# EasyEDA schematic Phantom Controller.json
TITLE: Phantom Controller; REV: 1.1; Date: 2022-01-25; Sheet: 1/1; Company: madtek.ro
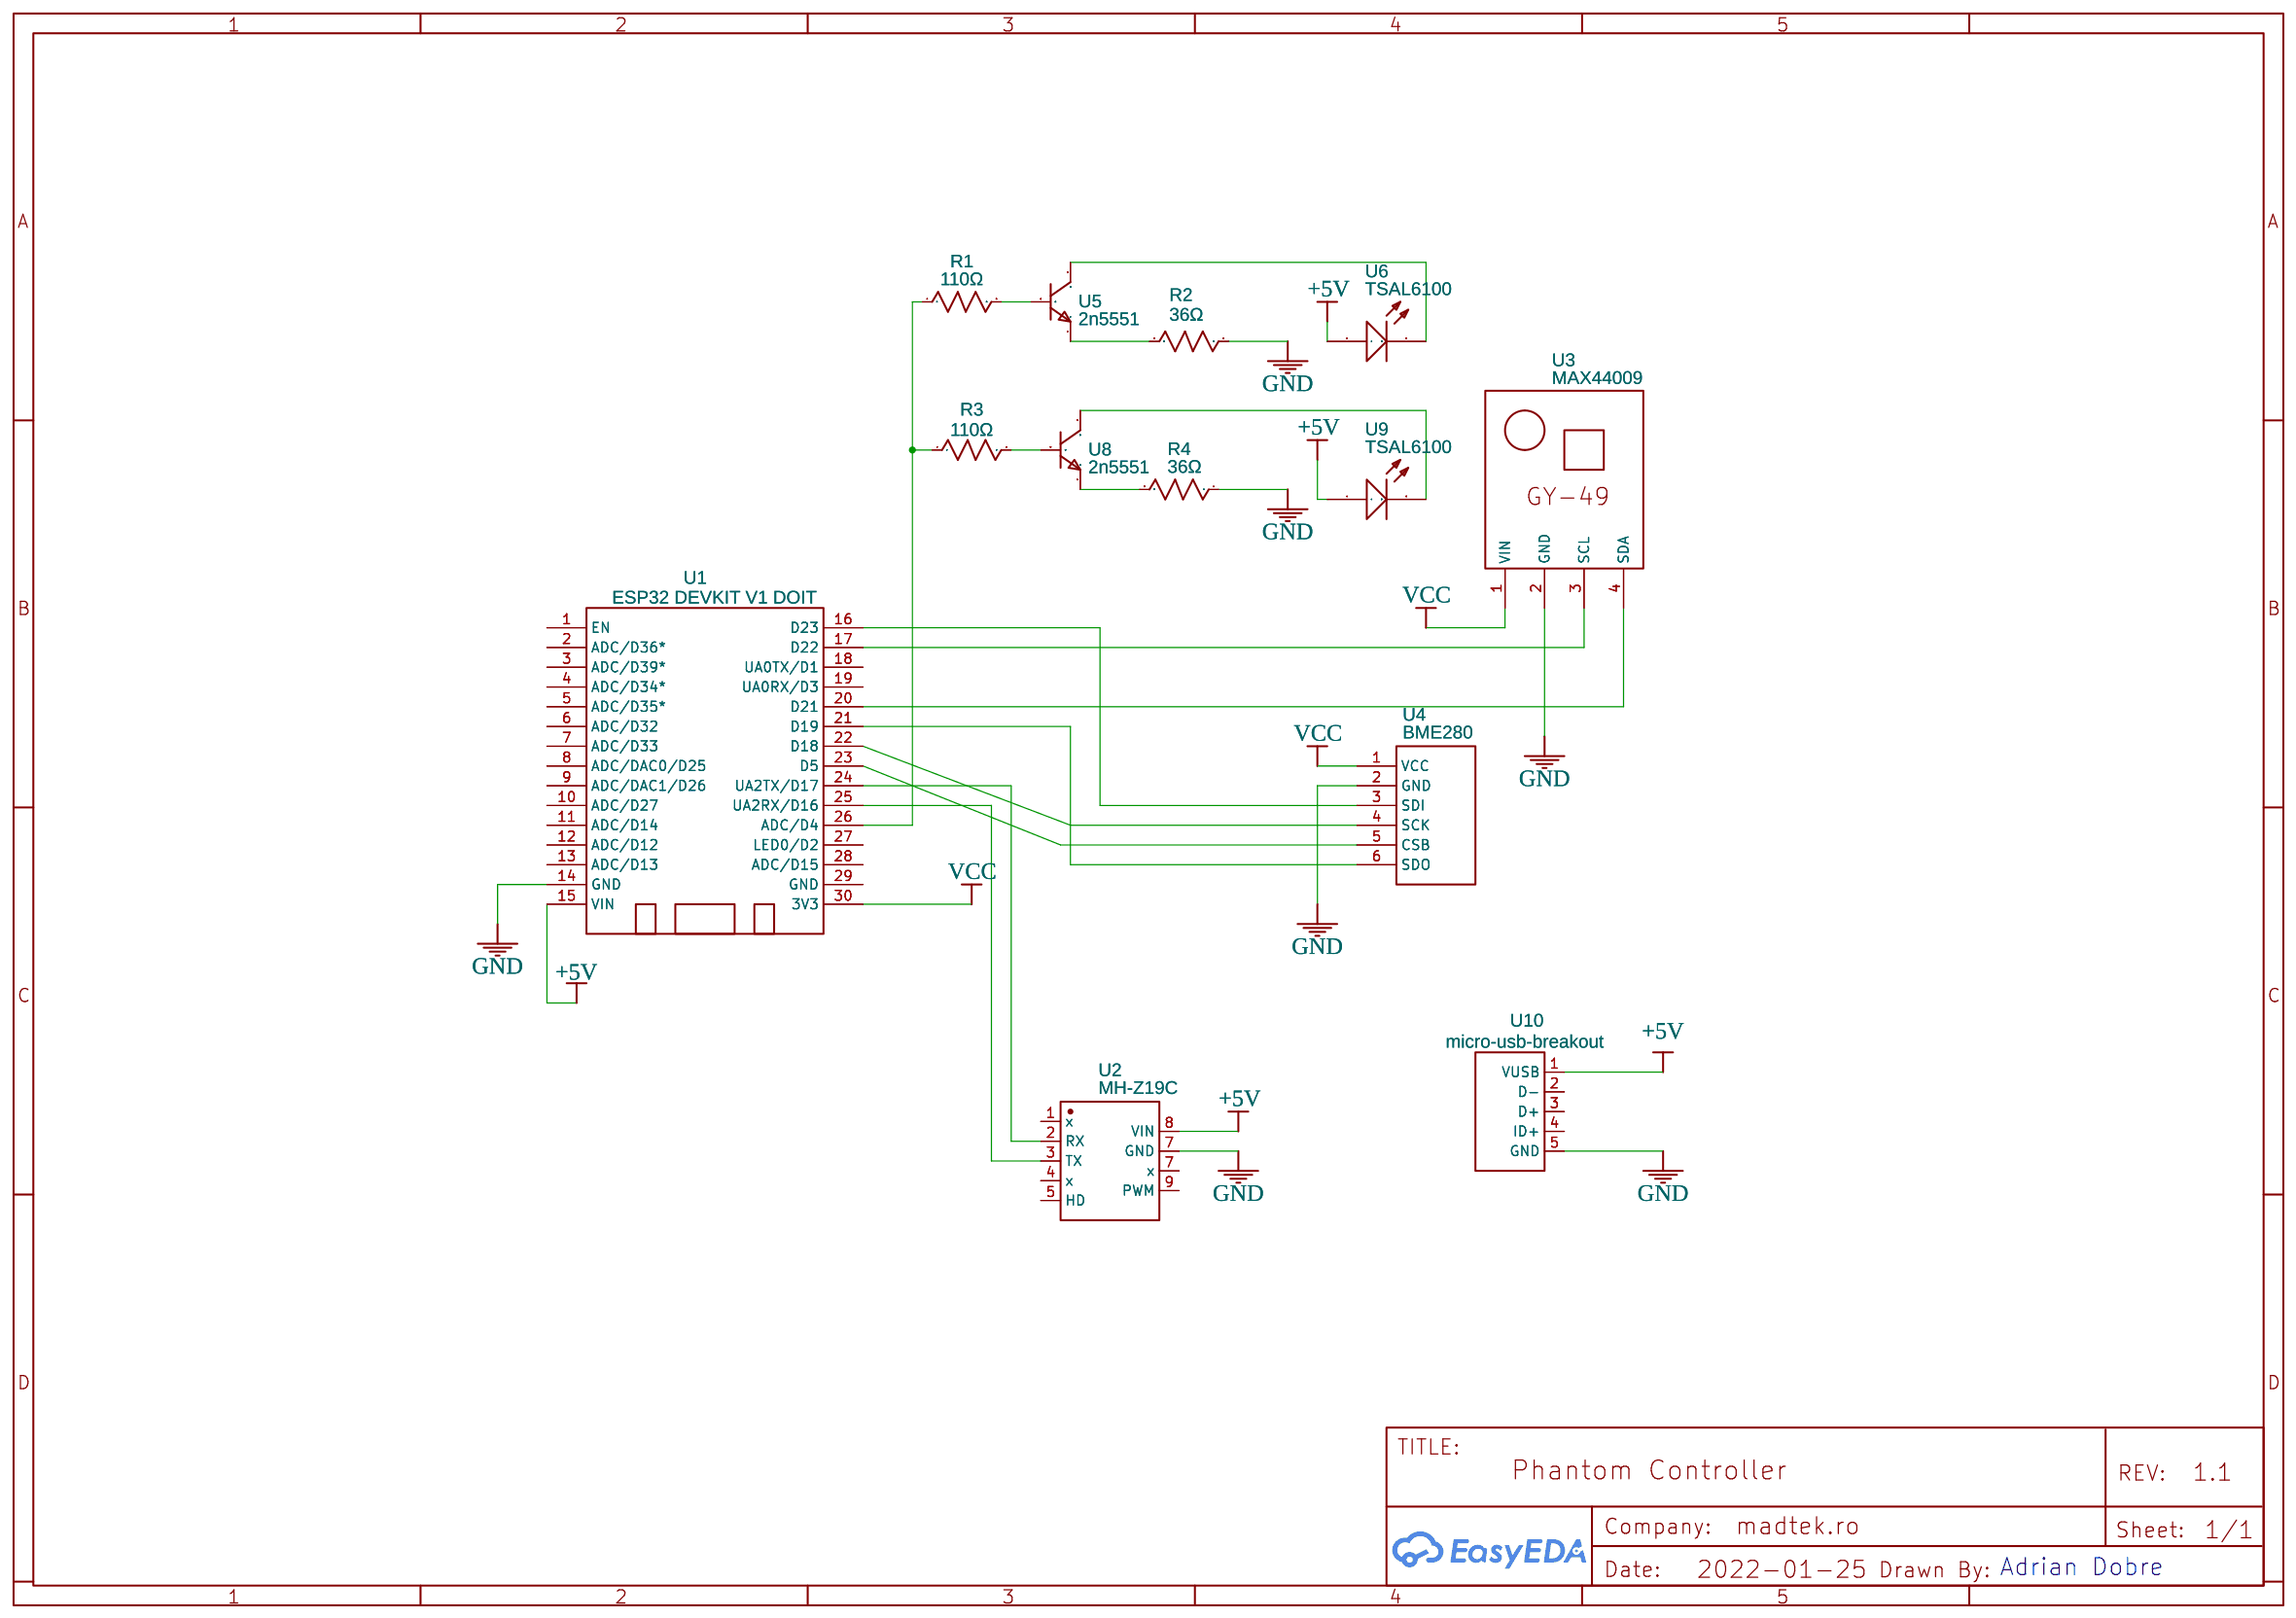
[diagram p0: schematic sheet]

## Parts
R1  110Ω  [THROUGH HOLE RESISTOR]
R2  36Ω  [THROUGH HOLE RESISTOR]
R3  110Ω  [THROUGH HOLE RESISTOR]
R4  36Ω  [THROUGH HOLE RESISTOR]
U1  ESP32 DEVKIT V1 DOIT  [DOIT-ESP32-DEVKIT-V1]
U2  MH-Z19C  [MH-Z19C_FOOTPRINT]
U3  MAX44009  [GY-49 4-PIN]
U4  BME280  [BME280]
U5  2n5551  [2N5551]
U6  TSAL6100  [LED-TH_BD5.8-P2.54-FD]
U8  2n5551  [2N5551]
U9  TSAL6100  [LED-TH_BD5.8-P2.54-FD]
U10  micro-usb-breakout  [MICROUSB-BREAKOUT]

## Library data of the parts
R1-R4 = Res: Contributor: andres_c
U1 = ESP32 DEVKIT V1 DOIT: Contributor: ConceitoTeam
U2 = MH-Z19C_sym: Contributor: stevebellnzl
U3 = BMP 280 4-PIN: Contributor: adal1
U4 = BME280: Contributor: Pjanssen
U5 U8 = 2n5551: Contributor: Dan Catalin
U6 U9 = TSAL6100: Supplier: LCSC; Manufacturer: VISHAY; Contributor: LCSC; Supplier Part: C111836; JLCPCB Part Class: Extended Part
U10 = micro-usb-breakout: Contributor: revoks

## Nets
+5V: U1.15(VIN) U2.8(VIN) U6.1(A) U9.1(A) U10.1(VUSB)
GND: R2.1 R4.1 U1.14(GND) U2.7(GND) U3.2(GND) U4.2(GND) U10.5(GND)
VCC: U1.30(3V3) U3.1(VIN) U4.1(VCC)
Net-(R1-1): R1.1 R3.1 U1.26(ADC/D4)
Net-(R1-2): R1.2 U5.3(B)
Net-(R2-2): R2.2 U5.1(E)
Net-(R3-2): R3.2 U8.3(B)
Net-(R4-2): R4.2 U8.1(E)
Net-(U1-16): U1.16(D23) U4.3(SDI)
Net-(U1-17): U1.17(D22) U3.3(SCL)
Net-(U1-20): U1.20(D21) U3.4(SDA)
Net-(U1-21): U1.21(D19) U4.6(SDO)
Net-(U1-22): U1.22(D18) U4.4(SCK)
Net-(U1-23): U1.23(D5) U4.5(CSB)
Net-(U1-24): U1.24(UA2TX/D17) U2.2(RX)
Net-(U1-25): U1.25(UA2RX/D16) U2.3(TX)
Net-(U5-2): U5.2(C) U6.2(C)
Net-(U8-2): U8.2(C) U9.2(C)

Not connected (* = marked no-connect by the designer): U1 1(EN) 2(ADC/D36*) 3(ADC/D39*) 4(ADC/D34*) 5(ADC/D35*) 6(ADC/D32) 7(ADC/D33) 8(ADC/DAC0/D25) 9(ADC/DAC1/D26) 10(ADC/D27) 11(ADC/D14) 12(ADC/D12) 13(ADC/D13) 18(UA0TX/D1) 19(UA0RX/D3) 27(LED0/D2) 28(ADC/D15) 29(GND); U2 1(x) 4(x) 5(HD) 9(PWM); U10 2(D-) 3(D+) 4(ID+)

## Notes on the sheet
- Adrian Dobre
